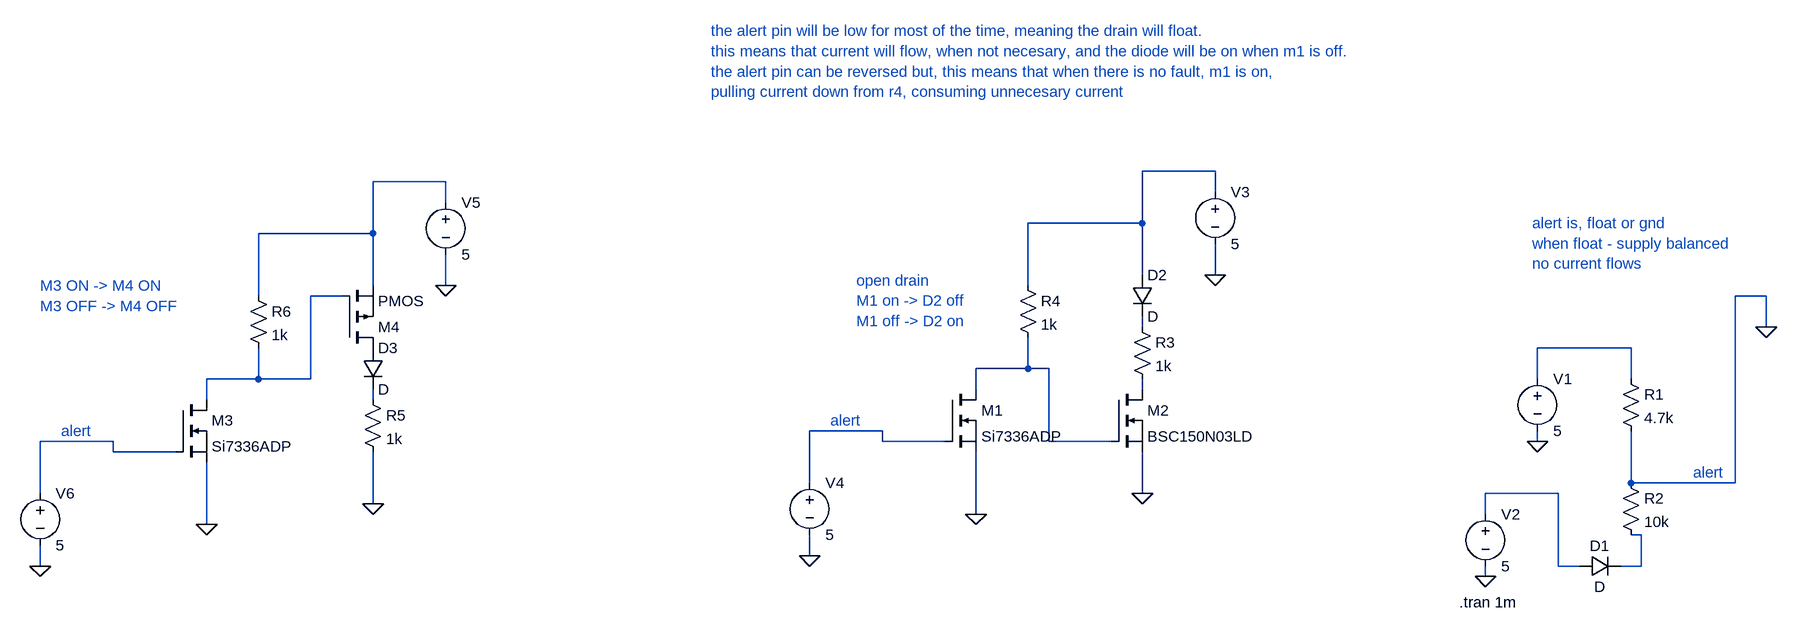
[diagram p0: schematic driving_led.asc]
driving_led.asc, the LTspice schematic file:
Version 4.1
SHEET 1 880 680
WIRE -240 -240 -352 -240
WIRE -1424 -224 -1536 -224
WIRE -240 -208 -240 -240
WIRE -1424 -192 -1424 -224
WIRE -352 -160 -352 -240
WIRE -352 -160 -528 -160
WIRE -1536 -144 -1536 -224
WIRE -1536 -144 -1712 -144
WIRE -352 -80 -352 -160
WIRE -240 -80 -240 -128
WIRE -1536 -64 -1536 -144
WIRE -1424 -64 -1424 -112
WIRE -528 -64 -528 -160
WIRE -1712 -48 -1712 -144
WIRE -1584 -48 -1632 -48
WIRE 608 -48 560 -48
WIRE -352 0 -352 -16
WIRE 608 0 608 -48
WIRE 400 32 256 32
WIRE -528 64 -528 16
WIRE -528 64 -608 64
WIRE -496 64 -528 64
WIRE -1712 80 -1712 32
WIRE -1712 80 -1792 80
WIRE -1632 80 -1632 -48
WIRE -1632 80 -1712 80
WIRE 256 80 256 32
WIRE 400 80 400 32
WIRE -608 96 -608 64
WIRE -352 96 -352 80
WIRE -1792 112 -1792 80
WIRE -1536 112 -1536 96
WIRE -752 160 -864 160
WIRE -1936 176 -2048 176
WIRE -752 176 -752 160
WIRE -656 176 -752 176
WIRE -496 176 -496 64
WIRE -400 176 -496 176
WIRE 256 176 256 160
WIRE -1936 192 -1936 176
WIRE -1840 192 -1936 192
WIRE -864 240 -864 160
WIRE 400 240 400 160
WIRE 560 240 560 -48
WIRE 560 240 400 240
WIRE -2048 256 -2048 176
WIRE -352 256 -352 192
WIRE 288 256 176 256
WIRE -1536 272 -1536 192
WIRE -608 288 -608 192
WIRE 176 288 176 256
WIRE -1792 304 -1792 208
WIRE 416 320 400 320
WIRE -864 352 -864 320
WIRE -2048 368 -2048 336
WIRE 288 368 288 256
WIRE 320 368 288 368
WIRE 416 368 416 320
WIRE 416 368 384 368
WIRE 176 384 176 368
FLAG 256 176 0
FLAG 176 384 0
FLAG 608 0 0
FLAG -352 256 0
FLAG -608 288 0
FLAG -864 352 0
FLAG -240 -80 0
FLAG -1536 272 0
FLAG -1792 304 0
FLAG -2048 368 0
FLAG -1424 -64 0
SYMBOL res 384 64 R0
SYMATTR InstName R1
SYMATTR Value 4.7k
SYMBOL res 384 224 R0
SYMATTR InstName R2
SYMATTR Value 10k
SYMBOL voltage 256 64 R0
WINDOW 123 0 0 Left 0
WINDOW 39 0 0 Left 0
SYMATTR InstName V1
SYMATTR Value 5
SYMBOL voltage 176 272 R0
WINDOW 123 0 0 Left 0
WINDOW 39 0 0 Left 0
SYMATTR InstName V2
SYMATTR Value 5
SYMBOL diode 320 384 R270
WINDOW 0 32 32 VTop 2
WINDOW 3 0 32 VBottom 2
SYMATTR InstName D1
SYMBOL nmos -656 96 R0
SYMATTR InstName M1
SYMATTR Value Si7336ADP
SYMBOL nmos -400 96 R0
SYMATTR InstName M2
SYMATTR Value BSC150N03LD
SYMBOL diode -368 -80 R0
SYMATTR InstName D2
SYMBOL res -368 -16 R0
SYMATTR InstName R3
SYMATTR Value 1k
SYMBOL voltage -240 -224 R0
WINDOW 123 0 0 Left 0
WINDOW 39 0 0 Left 0
SYMATTR InstName V3
SYMATTR Value 5
SYMBOL voltage -864 224 R0
WINDOW 123 0 0 Left 0
WINDOW 39 0 0 Left 0
SYMATTR InstName V4
SYMATTR Value 5
SYMBOL res -544 -80 R0
SYMATTR InstName R4
SYMATTR Value 1k
SYMBOL nmos -1840 112 R0
SYMATTR InstName M3
SYMATTR Value Si7336ADP
SYMBOL diode -1552 32 R0
SYMATTR InstName D3
SYMBOL res -1552 96 R0
SYMATTR InstName R5
SYMATTR Value 1k
SYMBOL voltage -1424 -208 R0
WINDOW 123 0 0 Left 0
WINDOW 39 0 0 Left 0
SYMATTR InstName V5
SYMATTR Value 5
SYMBOL voltage -2048 240 R0
WINDOW 123 0 0 Left 0
WINDOW 39 0 0 Left 0
SYMATTR InstName V6
SYMATTR Value 5
SYMBOL res -1728 -64 R0
SYMATTR InstName R6
SYMATTR Value 1k
SYMBOL pmos -1584 32 M180
SYMATTR InstName M4
TEXT 136 424 Left 2 !.tran 1m
TEXT -792 -72 Left 2 ;open drain\nM1 on -> D2 off\nM1 off -> D2 on
TEXT -832 144 Left 2 ;alert
TEXT 496 224 Left 2 ;alert
TEXT 248 -160 Left 2 ;alert is, float or gnd\nwhen float - supply balanced\nno current flows
TEXT -1016 -456 Left 2 ;the alert pin will be low for most of the time, meaning the drain will float. \nthis means that current will flow, when not necesary, and the diode will be on when m1 is off. \nthe alert pin can be reversed but, this means that when there is no fault, m1 is on, \npulling current down from r4, consuming unnecesary current
TEXT -2016 160 Left 2 ;alert
TEXT -2048 -64 Left 2 ;M3 ON -> M4 ON\nM3 OFF -> M4 OFF

The netlist it stands for:
* driving_led.asc
R1 N005 0 4.7k
R2 0 N012 10k
V1 N005 0 5
V2 N011 0 5
D1 N011 N012 D
M1 N006 N009 0 0 Si7336ADP
M2 N007 N006 0 0 BSC150N03LD
D2 N001 N004 D
R3 N004 N007 1k
V3 N001 0 5
V4 N009 0 5
R4 N001 N006 1k
M3 N003 N010 0 0 Si7336ADP
D3 P001 N008 D
R5 N008 0 1k
V5 N002 0 5
V6 N010 0 5
R6 N002 N003 1k
M4 P001 N003 N002 N002 PMOS
.model D D
.lib standard.dio
.model NMOS NMOS
.model PMOS PMOS
.lib standard.mos
.tran 1m
* open drain
* M1 on -> D2 off
* M1 off -> D2 on
* alert
* alert
* alert is, float or gnd
* when float - supply balanced
* no current flows
* the alert pin will be low for most of the time, meaning the drain will float.
* this means that current will flow, when not necesary, and the diode will be on when m1 is off.
* the alert pin can be reversed but, this means that when there is no fault, m1 is on,
* pulling current down from r4, consuming unnecesary current
* alert
* M3 ON -> M4 ON
* M3 OFF -> M4 OFF
.backanno
.end